# Altium schematic sheet io_b.SchDoc: I/O bank B
size A4; SheetNumber: 10; SheetTotal: 11
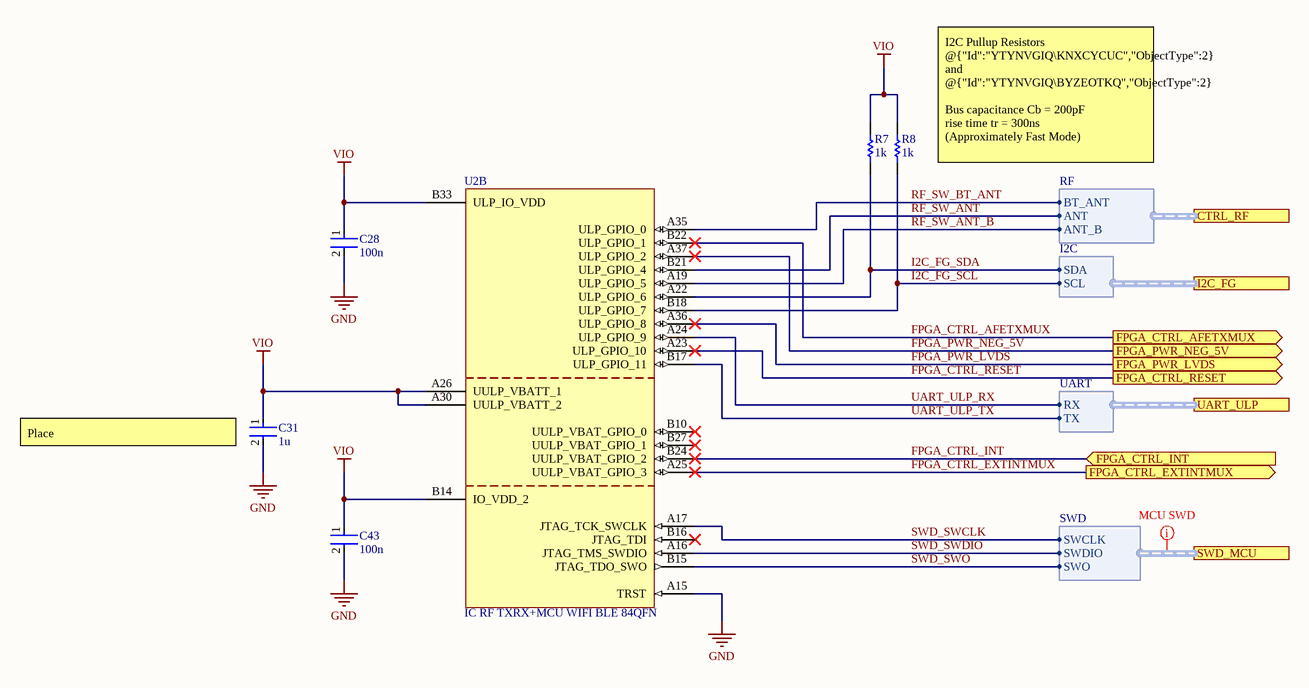
[diagram p0: io_b.SchDoc]

## Parts
C28  100n  [FP-GRT155-0_05-MFG]
C31  1u  [FP-GRM155-0_05-MFG]
C43  100n  [FP-GRT155-0_05-MFG]
R7  1k  [RESC1005X40X25LL05T10]
R8  1k  [RESC1005X40X25LL05T10]
U2  IC RF TXRX+MCU WIFI BLE 84QFN  [SIWG917M110LGTBA]  (part B of 4)

## Ports
CTRL_RF (harness RF, see power_io[6C], rf_clocks[1C]), FPGA_CTRL_AFETXMUX (out, see power_io[6C]), FPGA_CTRL_EXTINTMUX (out, see power_io[6C]), FPGA_CTRL_INT (in, see power_io[6C]), FPGA_CTRL_RESET (out, see power_io[6C]), FPGA_PWR_LVDS (out, see power_io[6C]), FPGA_PWR_NEG_5V (out, see power_io[6C]), I2C_FG (harness I2C, see power_io[6C], connectors[2B], power_conversion[1A], power_io[6C]), SWD_MCU (harness SWD, see power_io[6C], debug_interface[3B], power_io[6C]), UART_ULP (harness UART, see power_io[6C], debug_interface[3B], power_io[6C])

## Harnesses
I2C: SDA, SCL
RF: BT_ANT, ANT, ANT_B
UART: RX, TX
SWD: SWCLK, SWDIO, SWO

## Nets
GND: C28.2 C31.2 C43.2 U2.A15(TRST)
VIO: C28.1 C31.1 C43.1 R7.2 R8.2 U2.A26(UULP_VBATT_1) U2.A30(UULP_VBATT_2) U2.B14(IO_VDD_2) U2.B33(ULP_IO_VDD)
FPGA_CTRL_AFETXMUX: U2.B22(ULP_GPIO_1) ; port FPGA_CTRL_AFETXMUX
FPGA_CTRL_EXTINTMUX: U2.A25(UULP_VBAT_GPIO_3) ; port FPGA_CTRL_EXTINTMUX
FPGA_CTRL_INT: U2.B24(UULP_VBAT_GPIO_2) ; port FPGA_CTRL_INT
FPGA_CTRL_RESET: U2.A23(ULP_GPIO_10) ; port FPGA_CTRL_RESET
FPGA_PWR_LVDS: U2.A36(ULP_GPIO_8) ; port FPGA_PWR_LVDS
FPGA_PWR_NEG_5V: U2.A37(ULP_GPIO_2) ; port FPGA_PWR_NEG_5V
I2C_FG_SCL: R8.1 U2.B18(ULP_GPIO_7) ; port I2C_FG.SCL
I2C_FG_SDA: R7.1 U2.A22(ULP_GPIO_6) ; port I2C_FG.SDA
RF_SW_ANT: U2.B21(ULP_GPIO_4) ; port CTRL_RF.ANT
RF_SW_ANT_B: U2.A19(ULP_GPIO_5) ; port CTRL_RF.ANT_B
RF_SW_BT_ANT: U2.A35(ULP_GPIO_0) ; port CTRL_RF.BT_ANT
SWD_SWCLK: U2.A17(JTAG_TCK_SWCLK) ; port SWD_MCU.SWCLK
SWD_SWDIO: U2.A16(JTAG_TMS_SWDIO) ; port SWD_MCU.SWDIO
SWD_SWO: U2.B15(JTAG_TDO_SWO) ; port SWD_MCU.SWO
UART_ULP_RX: U2.A24(ULP_GPIO_9) ; port UART_ULP.RX
UART_ULP_TX: U2.B17(ULP_GPIO_11) ; port UART_ULP.TX

Not connected (* = marked no-connect by the designer): U2 B10(UULP_VBAT_GPIO_0)* B16(JTAG_TDI)* B27(UULP_VBAT_GPIO_1)*

## Layout directives
net class SWD_MCU: (no net found under the mark)

## Notes on the sheet
- (near R8) I2C Pullup Resistors @{"Id":"YTYNVGIQ\KNXCYCUC","ObjectType":2} and @{"Id":"YTYNVGIQ\BYZEOTKQ","ObjectType":2}
  Bus capacitance Cb = 200pF
  rise time tr = 300ns
  (Approximately Fast Mode)
  Pullup resistance Rp
  min = 720Ohm
  max = 1770Ohm
- (near C31) Place @{"Id":"YTYNVGIQ\TQWKBKJS","ObjectType":2} close to UULP_VBATT_2
- Project:
- Laboratory:
- Date:
- File:
- Rev:
- Variation:
- Drawn By:
- Checked By:
- Sheet:
- /

## Library data of the parts
C28 C43 = CMP-06035-014200-1: Multi-Layer Ceramic Capacitor 100nF 50V X7R ±10% 0402 Paper T/R
C31 = CMP-06035-025126-1: Chip Multilayer Ceramic Capacitors for General Purpose, 0402, 1.0uF, X6S, 22%, 10%, 16V; Capacitance: 1uF; Thickness: 500um; Voltage Rating (DC): 16V; Tolerance: 10%; Width: 500um; Length: 1mm; Dielectric: X6S
R7 R8 = CMP-2002-07865-1: Manufacturer: Yageo; Part Number: RC0402FR-131KL
U2 = SIWG917